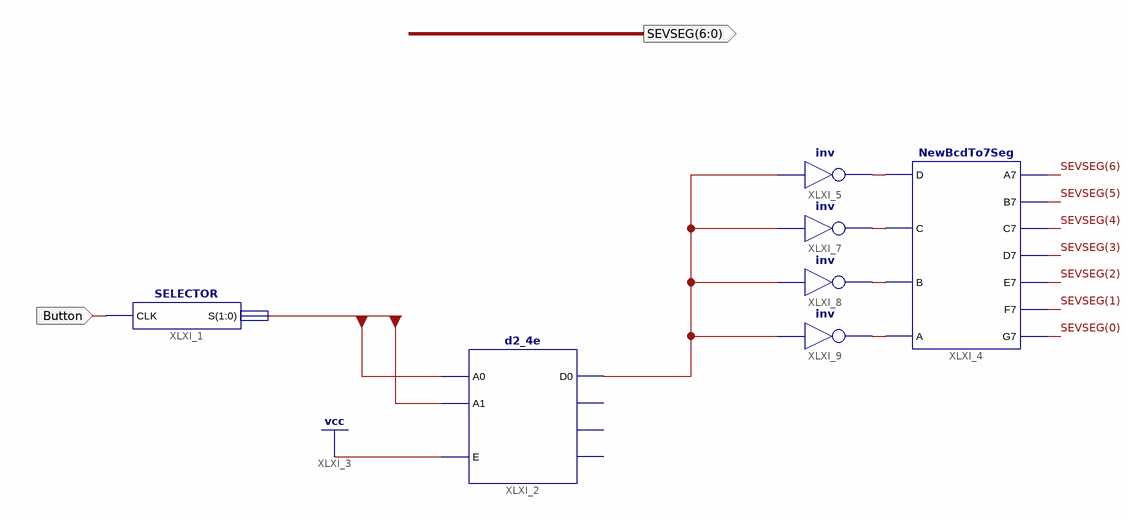
[diagram p0: schematic sheet 1]
// Xilinx ISE schematic main.sch (spartan6) as structural Verilog: 7 symbols, 2 ports
module main (
  input  Button,
  output [6:0] SEVSEG
);

  wire XLXN_5, XLXN_6, XLXN_7, XLXN_8, XLXN_9, XLXN_10, XLXN_14;
  wire [1:1] XLXN_2;

  SELECTOR XLXI_1 (.CLK(Button), .S(XLXN_2[1]));
  d2_4e XLXI_2 (.A0(XLXN_5), .A1(XLXN_6), .E(1'b1), .D0(XLXN_14));  // open: D1, D2, D3
  NewBcdTo7Seg XLXI_4 (
    .D(XLXN_7), .C(XLXN_8), .B(XLXN_9), .A(XLXN_10), .A7(SEVSEG[6]), .B7(SEVSEG[5]), .C7(SEVSEG[4]),
    .D7(SEVSEG[3]), .E7(SEVSEG[2]), .F7(SEVSEG[1]), .G7(SEVSEG[0]));
  not XLXI_5 (XLXN_7, XLXN_14);
  not XLXI_7 (XLXN_8, XLXN_14);
  not XLXI_8 (XLXN_9, XLXN_14);
  not XLXI_9 (XLXN_10, XLXN_14);
endmodule
